# EAGLE design breakout_KL27Z_QFP64 (EAGLE 7.4.0)
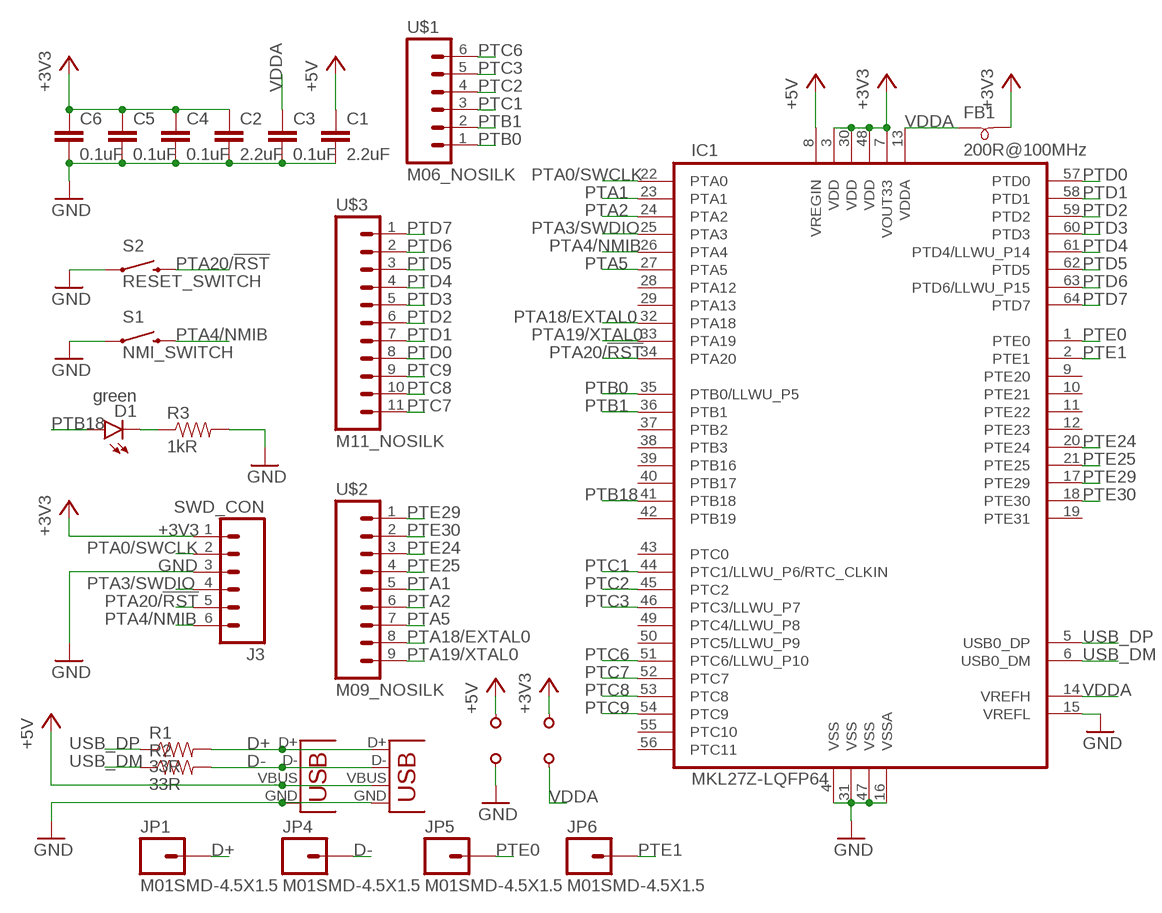
[diagram p0: schematic, sheet 1]

## Parts
C1  2.2uF  CAPACITOR0805  [0805]
C2  2.2uF  CAPACITOR0805  [0805]
C3  0.1uF  CAPACITOR0805  [0805]
C4  0.1uF  CAPACITOR0805  [0805]
C5  0.1uF  CAPACITOR0805  [0805]
C6  0.1uF  CAPACITOR0805  [0805]
D1  green  LED805  [LED-805]
FB1  200R@100MHz  FERRITE-BEAD0805  [0805]
IC1  MKL27Z-LQFP64  [TQFP-64-0.5]
J3  SWD_CON  M06_NOSILK_1SQ  [M06_NOSILK_1SQ]
JP1  M01SMD-4.5X1.5  [PAD-1.5X4.5]
JP2  USBSMD  [USB-MINIB]
JP3  USB-MICROB  [USB-MICROB]
JP4  M01SMD-4.5X1.5  [PAD-1.5X4.5]
JP5  M01SMD-4.5X1.5  [PAD-1.5X4.5]
JP6  M01SMD-4.5X1.5  [PAD-1.5X4.5]
R1  33R  RESISTOR0805  [0805]
R2  33R  RESISTOR0805  [0805]
R3  1kR  RESISTOR0805  [0805]
S1  NMI_SWITCH  SWITCH-MOMENTARY-2SMD-REDUNDANT  [TACTILE-SWITCH-SMD]
S2  RESET_SWITCH  SWITCH-MOMENTARY-2SMD-REDUNDANT  [TACTILE-SWITCH-SMD]
U$1  M06_NOSILK  [M06_NOSILK]
U$2  M09_NOSILK  [M09_NOSILK]
U$3  M11_NOSILK  [M11_NOSILK]
U$4  M01_1SQ  [M01_1SQ]
U$5  M01_1SQ  [M01_1SQ]
U$6  M01_NOSILK  [M01_NOSILK]
U$7  M01_1SQ  [M01_1SQ]

## Nets
+3V3: C2.1 C4.1 C5.1 C6.1 FB1.2 IC1.3(VDD) IC1.7(VOUT33) IC1.30(VDD) IC1.48(VDD) J3.1 U$5.1
+5V: C1.1 IC1.8(VREGIN) JP2.VBUS JP3.VBUS U$4.1
D+: JP1.P$1 JP2.D+ JP3.D+ R1.2
D-: JP2.D- JP3.D- JP4.P$1 R2.2
GND: C1.2 C2.2 C3.2 C4.2 C5.2 C6.2 IC1.4(VSS) IC1.15(VREFL) IC1.16(VSSA) IC1.31(VSS) IC1.47(VSS) J3.3 JP2.GND JP3.GND R3.2 S1.1 S1.2 S2.1 S2.2 U$6.1
N$5: D1.C R3.1
PTA0/SWCLK: IC1.22(PTA0) J3.2
PTA1: IC1.23(PTA1) U$2.5
PTA2: IC1.24(PTA2) U$2.6
PTA3/SWDIO: IC1.25(PTA3) J3.4
PTA4/NMIB: IC1.26(PTA4) J3.6 S1.3 S1.4
PTA5: IC1.27(PTA5) U$2.7
PTA18/EXTAL0: IC1.32(PTA18) U$2.8
PTA19/XTAL0: IC1.33(PTA19) U$2.9
PTA20/!RST: IC1.34(PTA20) J3.5 S2.3 S2.4
PTB0: IC1.35(PTB0/LLWU_P5) U$1.1
PTB1: IC1.36(PTB1) U$1.2
PTB18: D1.A IC1.41(PTB18)
PTC1: IC1.44(PTC1/LLWU_P6/RTC_CLKIN) U$1.3
PTC2: IC1.45(PTC2) U$1.4
PTC3: IC1.46(PTC3/LLWU_P7) U$1.5
PTC6: IC1.51(PTC6/LLWU_P10) U$1.6
PTC7: IC1.52(PTC7) U$3.11
PTC8: IC1.53(PTC8) U$3.10
PTC9: IC1.54(PTC9) U$3.9
PTD0: IC1.57(PTD0) U$3.8
PTD1: IC1.58(PTD1) U$3.7
PTD2: IC1.59(PTD2) U$3.6
PTD3: IC1.60(PTD3) U$3.5
PTD4: IC1.61(PTD4/LLWU_P14) U$3.4
PTD5: IC1.62(PTD5) U$3.3
PTD6: IC1.63(PTD6/LLWU_P15) U$3.2
PTD7: IC1.64(PTD7) U$3.1
PTE0: IC1.1(PTE0) JP5.P$1
PTE1: IC1.2(PTE1) JP6.P$1
PTE24: IC1.20(PTE24) U$2.3
PTE25: IC1.21(PTE25) U$2.4
PTE29: IC1.17(PTE29) U$2.1
PTE30: IC1.18(PTE30) U$2.2
USB_DM: IC1.6(USB0_DM) R2.1
USB_DP: IC1.5(USB0_DP) R1.1
VDDA: C3.1 FB1.1 IC1.13(VDDA) IC1.14(VREFH) U$7.1
Unconnected: IC1.9(PTE20) IC1.10(PTE21) IC1.11(PTE22) IC1.12(PTE23) IC1.19(PTE31) IC1.28(PTA12) IC1.29(PTA13) IC1.37(PTB2) IC1.38(PTB3) IC1.39(PTB16) IC1.40(PTB17) IC1.42(PTB19) IC1.43(PTC0) IC1.49(PTC4/LLWU_P8) IC1.50(PTC5/LLWU_P9) IC1.55(PTC10) IC1.56(PTC11)

## Library data of the parts
C1-C6 = flabbergast:CAPACITOR
D1 = flabbergast:LED: Blue LEDs for production use Various blue LEDs stocked by SparkFun production 0603 - DIO-08575 Rebel - DIO-09553 1206 - DIO-09911
FB1 = flabbergast:FERRITE-BEAD
IC1 = flabbergast:MKL27Z-LQFP64
J3 U$1 = flabbergast:M06
JP1 JP4-JP6 = SparkFun-Connectors:M01: Header 1 Standard 1-pin 0.1" header. Use with straight break away headers (SKU : PRT-00116), right angle break away headers (PRT-00553), swiss pins (PRT-00743), machine pins (PRT-00117), and female headers (PRT-00115).
JP2 = flabbergast:USB: USB Connectors USB-B-PTH is fully proven SKU : PRT-00139/CONN-08278 USB-miniB is fully proven SKU : PRT-00587 USB-A-PCB is untested. USB-A-H is throughly reviewed, but untested. Spark Fun Electronics SKU : PRT-00437 USB-B-SMT is throughly reviewed, but untested. Needs silkscreen touching up. USB-A-S has not been used/tested USB-MB-H has not been used/tested USB-MICROB has been used. CONN-09505; PROD_ID: CONN-08193
JP3 = flabbergast:USB: USB Connectors USB-B-PTH is fully proven SKU : PRT-00139/CONN-08278 USB-miniB is fully proven SKU : PRT-00587 USB-A-PCB is untested. USB-A-H is throughly reviewed, but untested. Spark Fun Electronics SKU : PRT-00437 USB-B-SMT is throughly reviewed, but untested. Needs silkscreen touching up. USB-A-S has not been used/tested USB-MB-H has not been used/tested USB-MICROB has been used. CONN-09505; PROD_ID: CONN-09505
R1-R3 = flabbergast:RESISTOR
S1 S2 = SparkFun-Electromechanical:SWITCH-MOMENTARY-2: Various NO switches- pushbuttons, reed, etc
U$2 = flabbergast:M09
U$3 = flabbergast:M11
U$4-U$7 = flabbergast:M01

## Board
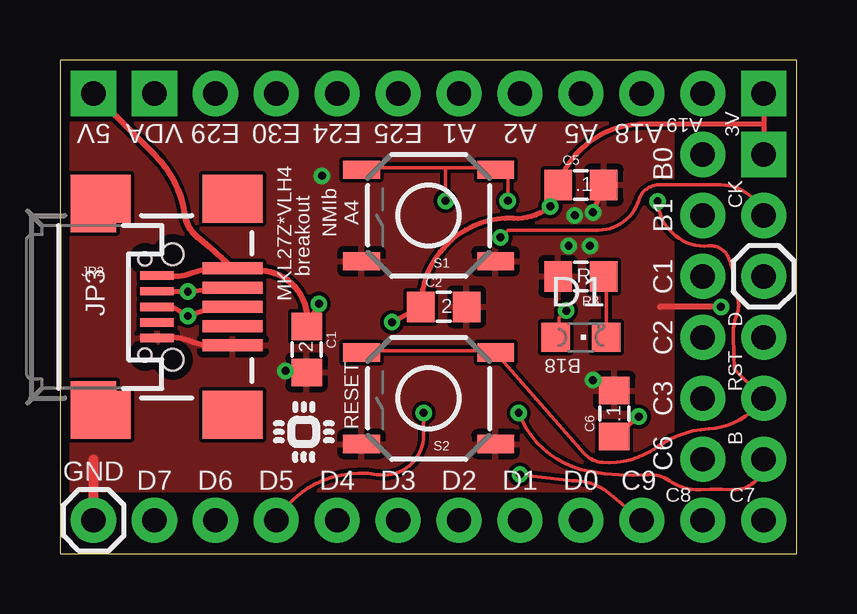
[diagram p1: board, top side]
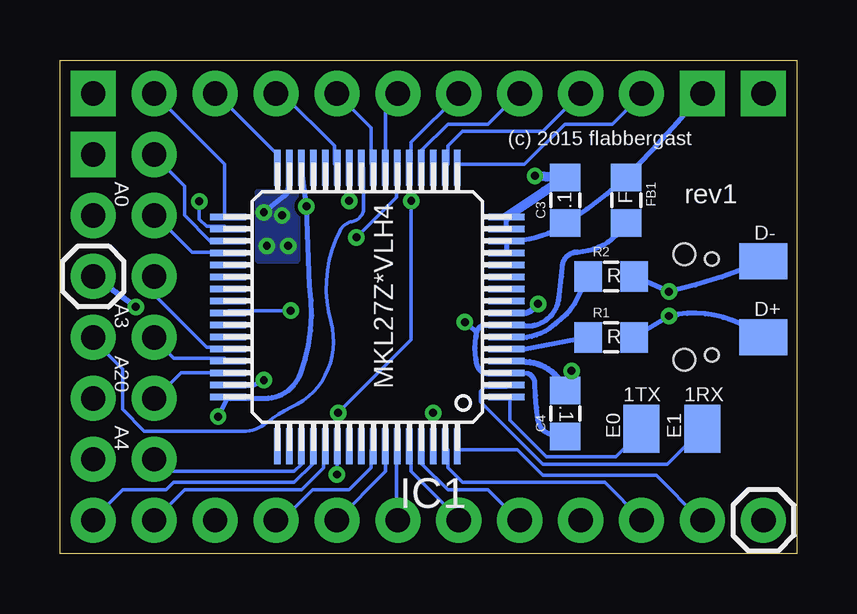
[diagram p2: board, bottom side, seen from below]

Size 30.72 x 20.57 mm. Coordinates in mm from the lower left corner, seen from the top.
Outline: 0,20.57 0,0 30.72,0 30.72,20.57 0,20.57
Copper layers (1*16): Top 0.0356mm / dielectric 1.5011mm / Bottom 0.0356mm
Design rules "LaenPCBOrder *": minimum track width 6mil, minimum drill 13mil, track to track 6mil, track to pad 6mil, pad to pad 6mil, via to via 6mil, smd to smd 0mil, copper to edge 15mil, drill to drill 6mil, minimum pad ring 7mil, minimum via ring 7mil, stop-mask expansion 3mil, vias tented up to drill 14mil, thermal gap 10mil

### Footprints (pad centres in the part's own frame; a part is rotated, then mirrored left to right if it is on the bottom)
0805 = smd 1.143 x 1.27: 1 -0.953,0; 2 0.953,0
LED-805 = smd 1.2 x 1.2: A 0,-1.05; C 0,1.05
TQFP-64-0.5 = smd 1.5 x 0.28: 1 -5.8,3.75; 2 -5.8,3.25; 3 -5.8,2.75; 4 -5.8,2.25; 5 -5.8,1.75; 6 -5.8,1.25; 7 -5.8,0.75; 8 -5.8,0.25; 9 -5.8,-0.25; 10 -5.8,-0.75; 11 -5.8,-1.25; 12 -5.8,-1.75; 13 -5.8,-2.25; 14 -5.8,-2.75; 15 -5.8,-3.25; 16 -5.8,-3.75; 33 5.8,-3.75; 34 5.8,-3.25; 35 5.8,-2.75; 36 5.8,-2.25; 37 5.8,-1.75; 38 5.8,-1.25; 39 5.8,-0.75; 40 5.8,-0.25; 41 5.8,0.25; 42 5.8,0.75; 43 5.8,1.25; 44 5.8,1.75; 45 5.8,2.25; 46 5.8,2.75; 47 5.8,3.25; 48 5.8,3.75 | smd 0.28 x 1.5: 17 -3.75,-5.8; 18 -3.25,-5.8; 19 -2.75,-5.8; 20 -2.25,-5.8; 21 -1.75,-5.8; 22 -1.25,-5.8; 23 -0.75,-5.8; 24 -0.25,-5.8; 25 0.25,-5.8; 26 0.75,-5.8; 27 1.25,-5.8; 28 1.75,-5.8; 29 2.25,-5.8; 30 2.75,-5.8; 31 3.25,-5.8; 32 3.75,-5.8; 49 3.75,5.8; 50 3.25,5.8; 51 2.75,5.8; 52 2.25,5.8; 53 1.75,5.8; 54 1.25,5.8; 55 0.75,5.8; 56 0.25,5.8; 57 -0.25,5.8; 58 -0.75,5.8; 59 -1.25,5.8; 60 -1.75,5.8; 61 -2.25,5.8; 62 -2.75,5.8; 63 -3.25,5.8; 64 -3.75,5.8
M06_NOSILK_1SQ = drill 1.016 pad 1.88 square: 1 -6.35,0 | drill 1.016 pad 1.88: 2 -3.81,0; 3 -1.27,0; 4 1.27,0; 5 3.81,0; 6 6.35,0
PAD-1.5X4.5 = smd 1.5 x 2: P$1 0,0
USB-MINIB = smd 2.5 x 0.5: D+ 2.5,0; D- 2.5,0.8; GND 2.5,-1.6; ID 2.5,-0.8; VBUS 2.5,1.6 | smd 2.5 x 2: MTN1 -3,4.5; MTN2 2.5,4.5; MTN3 -3,-4.5; MTN4 2.5,-4.5 | hole 0.9: 0,2.2; 0,-2.2
USB-MICROB = smd 0.35 x 1.4: D+ 0,2.65; D- -0.65,2.65; GND 1.3,2.65; ID 0.65,2.65; VBUS -1.3,2.65 | smd 1.8 x 1.9: MT1 -4,0; MT2 4,0 | hole 0.55: -2,2.15; 2,2.15
TACTILE-SWITCH-SMD = smd 1.524 x 0.762: 1 -2.794,1.905; 2 2.794,1.905; 3 -2.794,-1.905; 4 2.794,-1.905
M06_NOSILK = drill 1.016 pad 1.88: 1 -6.35,0; 2 -3.81,0; 3 -1.27,0; 4 1.27,0; 5 3.81,0; 6 6.35,0
M09_NOSILK = drill 1.016 pad 1.88: 1 -10.16,0; 2 -7.62,0; 3 -5.08,0; 4 -2.54,0; 5 0,0; 6 2.54,0; 7 5.08,0; 8 7.62,0; 9 10.16,0
M11_NOSILK = drill 1.016 pad 1.88: 1 -12.7,0; 2 -10.16,0; 3 -7.62,0; 4 -5.08,0; 5 -2.54,0; 6 0,0; 7 2.54,0; 8 5.08,0; 9 7.62,0; 10 10.16,0; 11 12.7,0
M01_1SQ = drill 1.016 pad 1.88 square: 1 0,0
M01_NOSILK = drill 1.016 pad 1.88: 1 0,0

### Placement (x,y rotation side)
C1  10.29,8.51 270 top
C2  16,10.29 0 top
C3  9.65,14.73 90 bottom
C4  9.65,5.84 90 bottom
C5  21.72,15.37 0 top
C6  23.11,5.84 90 top
D1  21.72,9.02 270 top
FB1  7.11,14.73 270 bottom
IC1  17.91,10.29 180 bottom
J3  29.34,10.29 270 top
JP1  1.4,9.02 270 bottom
JP2  4.7,10.29 0 top
JP3  1.4,10.29 270 top
JP4  1.4,12.19 270 bottom
JP5  6.48,5.21 0 bottom
JP6  3.94,5.21 0 bottom
R1  7.75,9.02 0 bottom
R2  7.75,11.56 0 bottom
R3  21.72,11.56 180 top
S1  15.37,14.1 180 top
S2  15.37,6.48 180 top
U$1  26.8,10.29 270 top
U$2  16.64,19.18 0 top
U$3  16.64,1.4 0 top
U$4  1.4,19.18 270 top
U$5  29.34,19.18 270 top
U$6  1.4,1.4 270 top
U$7  3.94,19.18 270 top
U$8  [IC_TINY]  10.16,5.08 0 top

### Tracks (layer width: path | path; a pad name or v marks a point on that pad's centre or on a via)
+3V3  (via drill 0.33)
  Top 0.152: 20.8,15.47 C5.1 | 15.16,10.29 C2.1 | 20.34,14.4 v20.45,14.48
  Top 0.203: v13.84,9.65 C2.1 arc-93 18.92,13.97 arc40 20.34,14.4 | C5.1 v20.45,14.48 | v24.13,5.71 C6.1 | U$5.1 29.34,17.91 | 29.34,17.91 J3.1 | 29.34,17.91 24.13,17.91 arc66 20.8,15.47
  Bottom 0.152: 20.5,14.4 v20.45,14.48 | 23.7,6.48 IC1.48
  Bottom 0.203: C4.1 10.16,4.95 arc76 10.79,5.59 arc5 10.92,7.11 arc-63 11.18,7.49 IC1.3 12.83,7.49 arc81 13.33,7.87 arc26 13.33,9.27 | 13.33,9.27 arc87 12.95,9.52 arc-21 IC1.7 arc25 11.43,9.52 arc-27 10.92,9.52 arc-76 9.91,10.79 arc-2 9.78,11.94 arc92 9.14,12.57 arc-55 FB1.2 | v13.84,9.65 arc-22 13.33,9.27 | IC1.30 v20.45,14.48 20.32,11.18 arc30 20.7,7.49 arc69 22.17,6.48 23.7,6.48 | IC1.48 v24.13,5.71
+5V  (via drill 0.33)
  Top 0.229: JP3.VBUS 4.7,11.56 arc24 5.46,11.68 arc-30 JP2.VBUS
  Top 0.254: v10.79,10.41 C1.1 arc95 8.38,11.81 JP2.VBUS arc6 5.71,13.21 arc-43 5.21,14.1 arc37 3.94,16.64 U$4.1
  Bottom 0.254: IC1.8 11.3,10.03 arc-37 v10.79,10.41
D+  (via drill 0.33)
  Top 0.203: JP3.D+ 4.7,10.29 v5.33,9.91 6.1,10.16 JP2.D+
  Bottom 0.203: R1.2 v5.33,9.91 arc44 2.03,9.4 JP1.P$1
D-  (via drill 0.33)
  Top 0.203: JP3.D- 5.33,10.94 v5.33,10.92 JP2.D-
  Bottom 0.203: R2.2 v5.33,10.92 arc-9 2.03,11.94 JP4.P$1
GND  (via drill 0.33)
  Top 0.203: C5.2 v22.22,14.22 | C6.2 v22.22,7.24
  Top 0.229: JP3.GND 4.45,9.02 arc-25 5.33,8.89 arc29 JP2.GND
  Top 0.254: C1.2 10.29,7.75 v9.4,7.62 | v27.56,10.29 25.02,10.29
  Top 0.406: U$6.1 1.4,3.94
  Bottom 0.152: 10.59,15.16 10.54,15.09
  Bottom 0.203: IC1.15 IC1.16 | v22.22,7.24 22.73,6.99 IC1.47 | v22.22,14.22 21.46,14.86 arc-46 21.21,15.11 IC1.31
  Bottom 0.254: v9.4,7.62 C4.2 arc-67 11.3,8 IC1.4 | v27.56,10.29 J3.3
  Bottom 0.406: IC1.16 10.54,15.09 C3.2 v10.92,15.75
  other vias: 21.21,12.83 21.46,14.1 22.1,12.83
  pour Top: 0.13,2.67 25.53,2.67 25.53,17.91 0.13,17.91
  pour Bottom: 20.83,12.19 22.48,12.19 22.48,15.11 20.83,15.11
N$5
  Top 0.152: D1.C 22.78,9.07 22.78,11.51 R3.1
PTA0/SWCLK  (via drill 0.33)
  Top 0.152: v18.36,13.18 18.67,13.49 22.45,13.49 arc73 24.13,14.73 arc-82 25.15,15.37 27.56,15.37 arc-71 J3.2
  Bottom 0.152: v18.36,13.18 16.69,14.86 16.69,16.08 IC1.22
PTA1
  Bottom 0.152: U$2.5 17.14,18.67 17.14,16.23 IC1.23
PTA2
  Bottom 0.152: U$2.6 17.75,17.75 17.75,16.23 IC1.24
PTA3/SWDIO
  Bottom 0.152: IC1.25 18.06,16.08 18.06,14.4 arc77 18.54,13.84 arc-52 19.05,13.46 arc-43 19.43,9.65 arc81 21.08,6.1 arc-15 22.1,5.46 arc39 23.09,5.11 27.2,5.11 28.12,6.02 28.12,7.7 29.34,8.91 J3.4
PTA4/NMIB  (via drill 0.33)
  Top 0.152: v18.67,14.71 18.67,15.62 18.21,16.08 S1.3 18.06,16.08 16.08,16.08 | 16.08,16.08 12.57,16.08 S1.4 | v16.08,14.71 16.08,16.08 | J3.6 29.34,3.89 arc-92 28.07,2.67 arc5 26.67,2.67 arc-38 25.4,3.05 arc40 24.51,3.3 arc-14 22.1,3.43 arc-59 v19.13,5.87
  Bottom 0.152: v18.67,14.71 18.67,16.08 IC1.26 | v16.08,14.71 16.08,8.91 v19.13,5.87
PTA5
  Bottom 0.152: IC1.27 19.28,16.23 19.28,16.99 21.41,19.13 21.72,19.13 U$2.7
PTA18/EXTAL0
  Bottom 0.152: IC1.32 21.72,16.23 21.72,16.69 24.15,19.13 U$2.8
PTA19/XTAL0
  Bottom 0.152: U$2.9 23.85,16.23 23.85,14.1 IC1.33
PTA20/!RST  (via drill 0.33)
  Top 0.152: S2.4 12.57,8.46 18.06,8.46 S2.3 18.21,8.31 21.84,4.19 arc44 22.61,3.81 arc40 24.89,4.45 arc-32 27.05,5.21 arc52 J3.5 28.12,7.7 28.07,9.02 arc-21 28.19,9.91 arc50 28.19,10.79 arc-27 28.07,11.43 arc32 27.81,12.45 arc66 27.05,12.83 arc-91 v24.92,14.68
  Bottom 0.152: v24.92,14.68 24.92,13.94 24.61,13.64 23.85,13.64 IC1.34
PTB0
  Bottom 0.152: IC1.35 23.85,13.03 24.46,13.03 25.53,14.1 25.53,15.32 26.75,16.54 U$1.1
PTB1
  Bottom 0.152: IC1.36 23.85,12.57 25.22,12.57 26.75,14.1 U$1.2
PTB18  (via drill 0.33)
  Top 0.152: v21.11,10.13 20.8,9.83 20.8,9.07 D1.A
  Bottom 0.152: v21.11,10.13 23.7,10.13 IC1.41
PTC1
  Bottom 0.152: IC1.44 23.85,8.61 24.61,8.61 26.75,10.74 26.75,11.51 U$1.3
PTC2
  Bottom 0.152: IC1.45 23.85,8.15 25.98,8.15 26.75,8.91 U$1.4
PTC3
  Bottom 0.152: IC1.46 23.85,7.54 25.68,7.54 26.75,6.48 U$1.5
PTC6
  Bottom 0.152: U$1.6 26.29,3.43 20.95,3.43 20.65,3.73 20.65,4.34 IC1.51
PTC7
  Bottom 0.152: IC1.52 20.19,4.34 20.19,3.73 20.95,2.97 25.98,2.97 26.29,2.67 28.12,2.67 29.34,1.45 U$3.11
PTC8
  Bottom 0.152: U$3.10 25.53,2.67 20.65,2.67 19.74,3.58 19.74,4.34 IC1.53
PTC9  (via drill 0.33)
  Top 0.152: U$3.9 22.86,2.54 arc42 21.34,3.05 v19.18,3.3
  Bottom 0.152: v19.18,3.3 IC1.54
PTD0
  Bottom 0.152: IC1.57 17.75,4.34 17.75,3.58 18.67,2.67 20.19,2.67 21.41,1.45 21.72,1.45 U$3.8
PTD1
  Bottom 0.152: U$3.7 17.14,3.43 17.14,4.34 IC1.58
PTD2
  Bottom 0.152: IC1.59 16.69,4.34 16.69,1.45 U$3.6
PTD3
  Bottom 0.152: IC1.60 16.08,4.34 16.08,3.43 14.1,1.45 U$3.5
PTD4
  Bottom 0.152: IC1.61 15.62,4.34 15.62,3.73 14.55,2.67 12.88,2.67 11.66,1.45 U$3.4
PTD5  (via drill 0.33)
  Top 0.152: v15.16,5.87 15.16,4.95 arc-100 13.21,3.3 arc68 U$3.3 9.07,1.45
  Bottom 0.152: v15.16,5.87 IC1.62
PTD6
  Bottom 0.152: IC1.63 14.55,4.34 14.55,3.58 13.94,2.97 8,2.97 6.48,1.45 U$3.2
PTD7
  Bottom 0.152: IC1.64 14.1,4.34 11.66,4.34 10.59,3.28 5.87,3.28 4.04,1.45 U$3.1
PTE0
  Bottom 0.152: IC1.1 11.96,6.48 11.96,5.56 10.44,4.04 7.54,4.04 6.48,5.11 JP5.P$1
PTE1
  Bottom 0.152: JP6.P$1 5.41,3.73 10.59,3.73 13.18,6.33 13.18,6.78 13.03,6.93 12.12,6.93 IC1.2
PTE24
  Bottom 0.152: IC1.20 15.62,16.23 15.62,16.84 14.55,17.91 12.88,17.91 11.66,19.13 U$2.3
PTE25
  Bottom 0.152: IC1.21 16.08,16.23 16.08,17.14 14.1,19.13 U$2.4
PTE29
  Bottom 0.152: IC1.17 14.1,16.23 11.35,16.23 9.68,17.91 7.7,17.91 6.48,19.13 U$2.1
PTE30
  Bottom 0.152: U$2.2 10.59,17.6 13.94,17.6 14.55,16.99 14.55,16.23 IC1.18
USB_DM
  Bottom 0.203: R2.1 9.27,10.41 arc18 10.29,9.4 arc46 IC1.6
USB_DP
  Bottom 0.203: R1.1 11.43,8.51 IC1.5
VDDA
  Bottom 0.203: IC1.13 IC1.14 11.43,13.08 arc-31 C3.1 arc-11 FB1.1 arc-5 U$7.1

### Text on the board
tPlace: 5V | VDA | E29 | E30 | E24 | E25 | A1 | A2 | A5 | A18 | A19 | 3V | B0 | .1 | CK | NMIb / A4 | B1 | breakout | C1 | MKL27Z*VLH4 | R | 2 | D | 2 | C2 | B18 | RST | RESET | C3 | .1 | B | C6 | GND | D7 | D6 | D5 | D4 | D3 | D2 | D1 | D0 | C9 | C8 | C7
bPlace: (c) 2015 flabbergast | rev1 | F | .1 | MKL27Z*VLH4 | A0 | D- | R | D+ | A3 | R | A20 | 1RX | 1TX | .1 | E1 | E0 | A4